# Altium schematic sheet PCB2.SchDoc
size A3; SheetNumber: 1; SheetTotal: 1
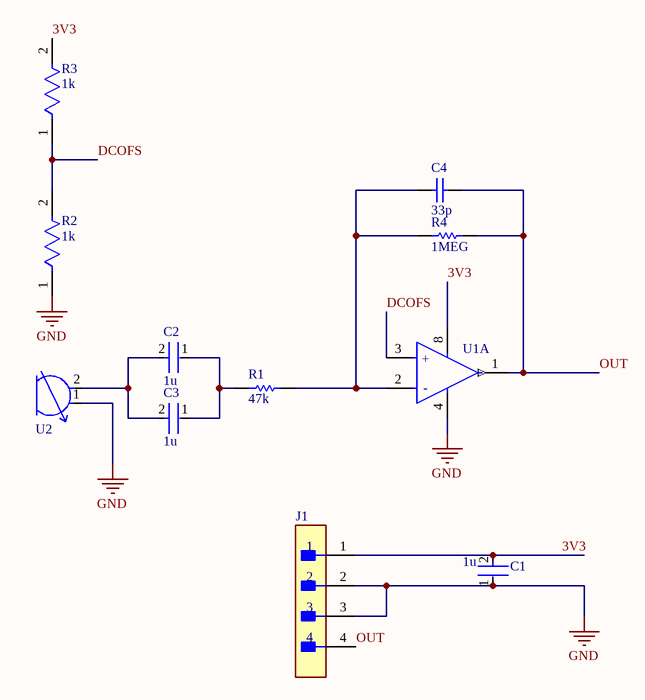
[diagram p0: PCB2.SchDoc]

## Parts
C1  1u  [FP-GRM31C-0_3-e0_3_0_9-IPC_C]
C2  1u  [FP-GRM31C-0_3-e0_3_0_9-IPC_C]
C3  1u  [FP-GRM31C-0_3-e0_3_0_9-IPC_C]
C4  33p  [CAPC1206(3216)170_L]
J1  HDR  [FP-MTLW-104-05-G-S-185-MFG]  (value not drawn)
R1  47k  [RESC3216X70X50LL05T20]
R2  1k  [FP-RMCF1206-MFG]
R3  1k  [FP-RMCF1206-MFG]
R4  1MEG  [RESC3216X70X40LL20T20]
U1  LM358DR2G  [FP-751-07-IPC_C]  (value not drawn)  (part A of 2)
U2  POM-3535P-3-R  [FP-POM-3535P-3-R-MFG]  (value not drawn)

## Nets
GND: C1.1 J1.2 J1.3 R2.1 U1.4(VEE/GND) U2.1(A)
3V3: C1.2 J1.1 R3.2 U1.8(VCC)
DCOFS: R2.2 R3.1 U1.3(INPUT_A+)
OUT: C4.2 J1.4 R4.2 U1.1(OUTPUT_A)
NetC2_1: C2.1 C3.1 R1.1
NetC2_2: C2.2 C3.2 U2.2(C)
NetC4_1: C4.1 R1.2 R4.1 U1.2(INPUT_A-)

## Notes on the sheet
- (in symbol CMP-1310-00291-2, part A) +; -

## Library data of the parts
C1-C3 = CMP-06035-014715-1: Chip Multilayer Ceramic Capacitors for General Purpose, 1206, 220uF, X5R, 15%, 20%, 4V; Termination: SMD/SMT; Capacitance: 220uF; Length: 0.126inch; Weight: 0.001411oz; Lead Free: Lead Free; Packaging: Tape and Reel; Voltage Rating: 4V; Dielectric: X5R; Voltage Rating (DC): 4V; Case Code (Metric): 3216; REACH SVHC: No SVHC; Mount: Surface Mount; Tolerance: 20%; Height: 1.6mm; Case Code (Imperial): 1206; Package Quantity: 2000; Width: 1.6mm; Thickness: 0.075inch; Case/Package: 1206; Max Operating Temperature: 85°C; Min Operating Temperature: -55°C
C4 = CMP-1037-01146-1: CAP 33pF 100V ±2% 1206 (3216 Metric) Thickness 1.7mm SMD; Case-Metric: 3216; Case-EIA: 1206; Tolerance: Â±2%; Rated Voltage: 100 V; Technology: SMT; Max Thickness: 1.7 mm; Value: 33pF
J1 = CMP-02766-000562-1: CONN HEADER VERT 4POS 2.54MM; Number of Contacts: 4; Contact Resistance: 15mR; Connector Type: Male Pin; Gender: Male; Contact Material: Brass; Height: 6.4mm; Contact Mating Length: 0.185inch; Length: 29.64mm; Number of Positions: 4; Packaging: Rail/Tube; Mount: Through Hole; Depth: 2.48mm; Number of Rows: 1; Radiation Hardening: No; Housing Material: Polymer; Pitch: 2.54mm; Max Operating Temperature: 105°C; Termination: Solder; Min Operating Temperature: -40°C; Color: Black; Orientation: Straight; Housing Color: Black; Contact Plating: Gold
R1 = CMP-2003-00637-1: Part Number: ERJ-8GEYJ473V; Manufacturer: Panasonic
R2 R3 = CMP-26527-000044-1: 1kΩ ±5% 0.25W 1206 Thick Film Chip Resistor AEC-Q200 compliant; Temperature Coefficient: 200ppm/°C; Power Rating: 250mW; Working Voltage: 200V; Resistance: 1kR; Min Operating Temperature: -55°C; Mount: Surface Mount; Number of Terminations: 2; Case Code (Imperial): 1206; Case Code (Metric): 3216; Packaging: Tape and Reel; Tolerance: 5%; Height: 0.028inch; Length: 3.2mm; Features: Automotive AEC-Q200; Depth: 1.6mm; RoHS Compliant: Yes; Resistor Type: Thick Film; Width: 0.063inch; Lead Free: Lead Free; Max Power Dissipation: 250mW; Construction: Rectangular; Case/Package: 1206; Max Operating Temperature: 155°C; Contact Plating: Tin; Radiation Hardening: No; Series: RMCF; Military Standard: Not
R4 = CMP-2003-04520-1: Manufacturer: KOA Speer; Part Number: RK73B2BTTD105J
U1 = CMP-1310-00291-2: IC OPAMP GP 2 CIRCUIT 8SOIC; Gain Bandwidth Product: 1MHz; Number of Circuits: 2; Min Supply Voltage: 3V; Slew Rate: 0.6V/µs; Max Dual Supply Voltage: 16V; Common Mode Rejection Ratio: 65dB; Input Bias Current: 250nA; Min Dual Supply Voltage: 1.5V; Dual Supply Voltage: 9V; Operating Supply Current: 1.5mA; Output Current: 40mA; Input Offset Voltage (Vos): 7mV; Nominal Supply Current: 1.2mA; Voltage Gain: 100dB; Max Supply Voltage: 32V; Width: 4mm; Number of Pins: 8; Min Operating Temperature: 0°C; REACH SVHC: No SVHC; Contact Plating: Tin; Lead Free: Lead Free; Halogen Free: Halogen Free; Power Supply Rejection Ratio (PSRR): 65dB; Operating Supply Voltage: 16V; Package Quantity: 2500; Max Operating Temperature: 70°C; Case/Package: SOIC; Height: 1.5mm; Packaging: Tape and Reel; Radiation Hardening: No; Number of Channels: 2; Bandwidth: 1MHz; Length: 5mm; Number of Elements: 2; Number of Amplifiers: 2; Output Current per Channel: 40mA
U2 = CMP-231723-000001-1: MIC COND ANALOG OMNI -35DB 6MM D; Resistance: 2200R; Direction: Omnidirectional; Impedance: 2.2kR; Shape: Round; Voltage Rating: 2V; Operating Supply Current: 500uA; Packaging: Bulk; Height: 3.7mm; Termination: PC Pins; Depth: 3.7mm; Diameter: 6mm; Mount: Through Hole; Package Quantity: 100; Output Type: Analog